# Altium schematic sheet Sheet1.SchDoc
size A
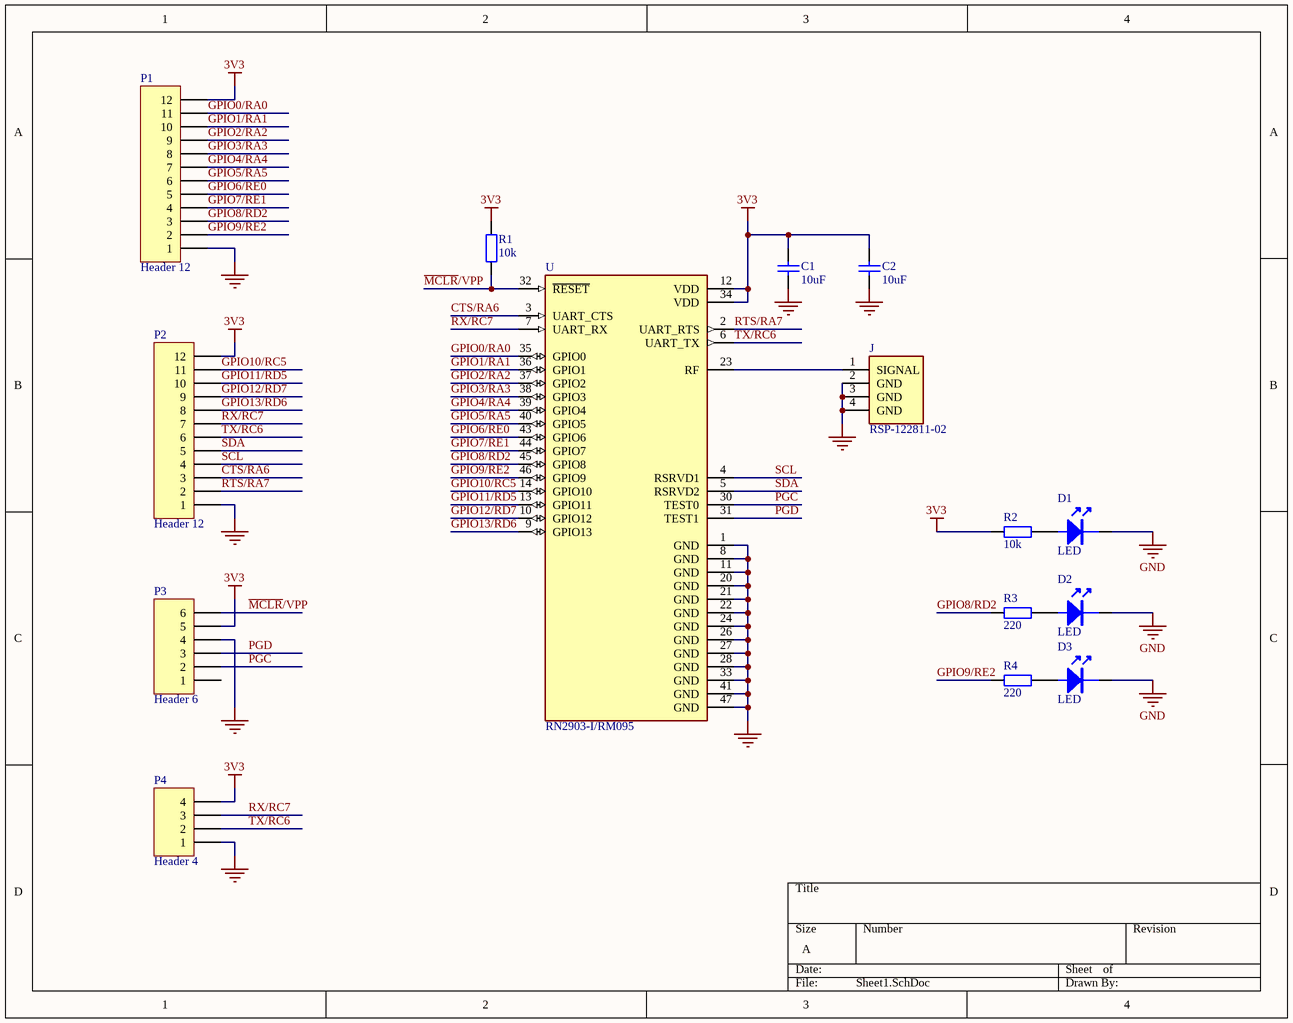
[diagram p0: Sheet1.SchDoc]

## Parts
C1  10uF  [0805 CAP]
C2  10uF  [0805 CAP]
D1  LED  [LED SMD 0805]
D2  LED  [LED SMD 0805]
D3  LED  [LED SMD 0805]
J  RSP-122811-02  [SAMTEC_RSP-122811-02]
P1  Header 12  [HDR1X12]
P2  Header 12  [HDR1X12]
P3  Header 6  [HDR1X6]
P4  Header 4  [HDR1X4]
R1  10k  [0805 RESISTOR]
R2  10k  [0805 RESISTOR]
R3  220  [0805 RESISTOR]
R4  220  [0805 RESISTOR]
U  RN2903-I/RM095  [XCVR_RN2903-I/RM095]

## Nets
3V3: C1.2 C2.2 P1.12 P2.12 P3.5 P4.4 R1.2 R2.1 U.12(VDD) U.34(VDD)
GND: C1.1 C2.1 D1.2 D2.2 D3.2 J.2(GND) J.3(GND) J.4(GND) P1.1 P2.1 P3.4 P4.1 U.1(GND) U.8(GND) U.11(GND) U.20(GND) U.21(GND) U.22(GND) U.24(GND) U.26(GND) U.27(GND) U.28(GND) U.33(GND) U.41(GND) U.47(GND)
CTS/RA6: P2.3 U.3(UART_CTS)
GPIO0/RA0: P1.11 U.35(GPIO0)
GPIO1/RA1: P1.10 U.36(GPIO1)
GPIO2/RA2: P1.9 U.37(GPIO2)
GPIO3/RA3: P1.8 U.38(GPIO3)
GPIO4/RA4: P1.7 U.39(GPIO4)
GPIO5/RA5: P1.6 U.40(GPIO5)
GPIO6/RE0: P1.5 U.43(GPIO6)
GPIO7/RE1: P1.4 U.44(GPIO7)
GPIO8/RD2: P1.3 R3.1 U.45(GPIO8)
GPIO9/RE2: P1.2 R4.1 U.46(GPIO9)
GPIO10/RC5: P2.11 U.14(GPIO10)
GPIO11/RD5: P2.10 U.13(GPIO11)
GPIO12/RD7: P2.9 U.10(GPIO12)
GPIO13/RD6: P2.8 U.9(GPIO13)
~{MCLR}/VPP: P3.6 R1.1 U.32(~{RESET})
PGC: P3.2 U.30(TEST0)
PGD: P3.3 U.31(TEST1)
RTS/RA7: P2.2 U.2(UART_RTS)
RX/RC7: P2.7 P4.3 U.7(UART_RX)
SCL: P2.4 U.4(RSRVD1)
SDA: P2.5 U.5(RSRVD2)
TX/RC6: P2.6 P4.2 U.6(UART_TX)
NetD1_1: D1.1 R2.2
NetD2_1: D2.1 R3.2
NetD3_1: D3.1 R4.2
NetJ_1: J.1(SIGNAL) U.23(RF)

Not connected (* = marked no-connect by the designer): P3 1

## Library data of the parts
C1 C2 = CAP CERAMIC: Published: 8-Jun-2000; LatestRevisionDate: 17-Jul-2002; LatestRevisionNote: Re-released for DXP Platform.; PackageReference: RAD-0.3; Publisher: Altium Limited
J = RSP-122811-02: IPEX MHF3 Connector Receptacle, Male Pin 50Ohm Surface Mount Solder; MF: Samtec Inc.; Availability: Unavailable; MP: RSP-122811-02; Package: None; SnapEDA_Link: https://www.snapeda.com/parts/RSP-122811-02/Samtec%20Inc./view-part/2771725/?ref=snap; Value: *; Price: None
P1 P2 = Header 12: Header, 12-Pin; LatestRevisionDate: 17-Jul-2002; LatestRevisionNote: Re-released for DXP Platform.; Publisher: Altium Limited
P3 = Header 6: Header, 6-Pin; LatestRevisionDate: 17-Jul-2002; LatestRevisionNote: Re-released for DXP Platform.; Publisher: Altium Limited
P4 = Header 4: Header, 4-Pin; LatestRevisionDate: 17-Jul-2002; LatestRevisionNote: Re-released for DXP Platform.; Publisher: Altium Limited
R1-R4 = RESISTOR: Value: R1/4W - 1K
U = RN2903-I/RM095: General ISM < 1GHz LoRaâ„¢ Transceiver Module 915MHz Antenna Not Included, SMA Surface Mount; MF: Microchip; Availability: Unavailable; Price: None; Package: Module Microchip; Value: *; SnapEDA_Link: https://www.snapeda.com/parts/RN2903-I/RM095/Microchip/view-part/465037/?ref=snap; MP: RN2903-I/RM095